# EAGLE design Strain gauge (EAGLE 9.6.2)
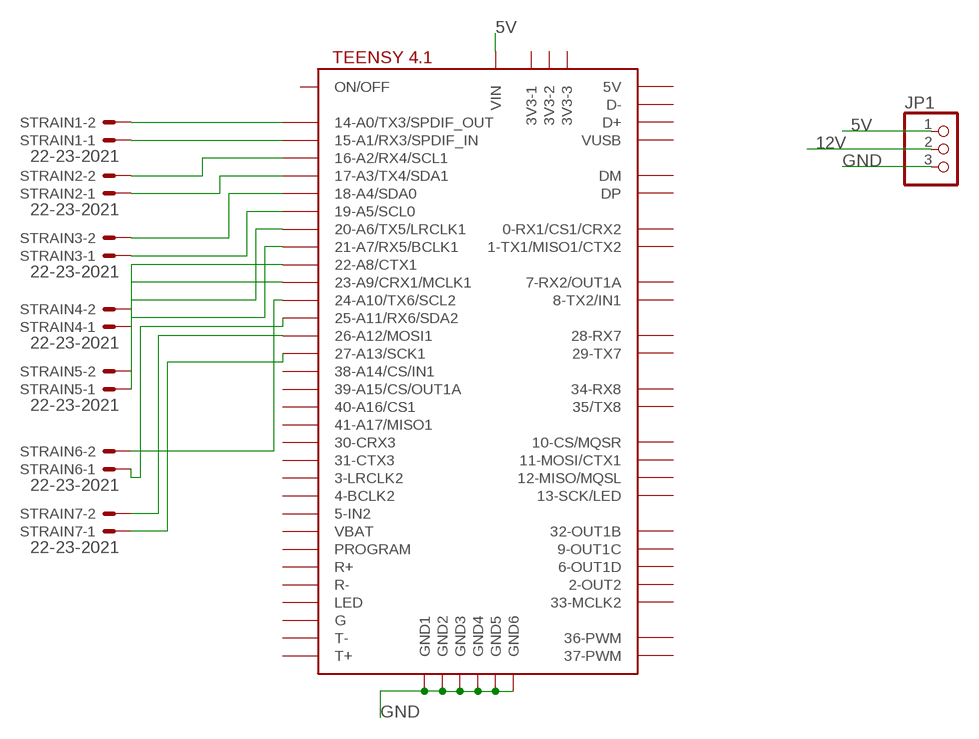
[diagram p0: schematic, sheet 1]

## Parts
JP1  PINHD-1X3  [1X03]
STRAIN1  22-23-2021  [22-23-2021]
STRAIN2  22-23-2021  [22-23-2021]
STRAIN3  22-23-2021  [22-23-2021]
STRAIN4  22-23-2021  [22-23-2021]
STRAIN5  22-23-2021  [22-23-2021]
STRAIN6  22-23-2021  [22-23-2021]
STRAIN7  22-23-2021  [22-23-2021]
U$1  TEENSY41  [TEENSY41]

## Nets
5V: JP1.1 U$1.VIN
12V: JP1.2
GND: JP1.3 U$1.GND1 U$1.GND2 U$1.GND3 U$1.GND4 U$1.GND5 U$1.GND6
N$1: STRAIN1.2 U$1.14-A0/TX3/SPDIF_OUT
N$2: STRAIN1.1 U$1.15-A1/RX3/SPDIF_IN
N$3: STRAIN2.2 U$1.16-A2/RX4/SCL1
N$4: STRAIN2.1 U$1.17-A3/TX4/SDA1
N$5: STRAIN3.2 U$1.18-A4/SDA0
N$6: STRAIN3.1 U$1.19-A5/SCL0
N$7: STRAIN4.2 U$1.20-A6/TX5/LRCLK1
N$8: STRAIN4.1 U$1.21-A7/RX5/BCLK1
N$9: STRAIN5.2 U$1.22-A8/CTX1
N$10: STRAIN5.1 U$1.23-A9/CRX1/MCLK1
N$11: STRAIN6.2 U$1.24-A10/TX6/SCL2
N$12: STRAIN6.1 U$1.25-A11/RX6/SDA2
N$13: STRAIN7.2 U$1.26-A12/MOSI1
N$14: STRAIN7.1 U$1.27-A13/SCK1
Unconnected: U$1.0-RX1/CS1/CRX2 U$1.1-TX1/MISO1/CTX2 U$1.2-OUT2 U$1.3-LRCLK2 U$1.3V3-1 U$1.3V3-2 U$1.3V3-3 U$1.4-BCLK2 U$1.5-IN2 U$1.6-OUT1D U$1.7-RX2/OUT1A U$1.8-TX2/IN2(8-TX2/IN1) U$1.9-OUT1C U$1.10-CS\MQSR(10-CS/MQSR) U$1.11-MOSI/CTX1 U$1.12-MISO/MQSL U$1.13-SCK/LED U$1.28-RX7 U$1.29-TX7 U$1.30-CRX3 U$1.31-CTX3 U$1.32-OUT1B U$1.33-MCLK2 U$1.34-RX8 U$1.35-TX8(35/TX8) U$1.36-PWM U$1.37-PWM U$1.38-A14/CS/IN1 U$1.39-A15/CS/OUT1A U$1.40-A16/CS1 U$1.41-A17/MISO1 U$1.+5V(5V) U$1.D+ U$1.D- U$1.DM U$1.DP U$1.G U$1.LED U$1.ON/OFF U$1.PROGRAM U$1.R+ U$1.R- U$1.T+ U$1.T- U$1.VBAT U$1.VUSB

## Library data of the parts
JP1 = adafruit:PINHD-1X3: PIN HEADER
STRAIN1-STRAIN7 = con-molex:22-23-2021: .100" (2.54mm) Center Header - 2 Pin; MF: MOLEX; MPN: 22-23-2021; OC_FARNELL: 1462926; OC_NEWARK: 25C3832
U$1 = teensy:TEENSY41

## Board
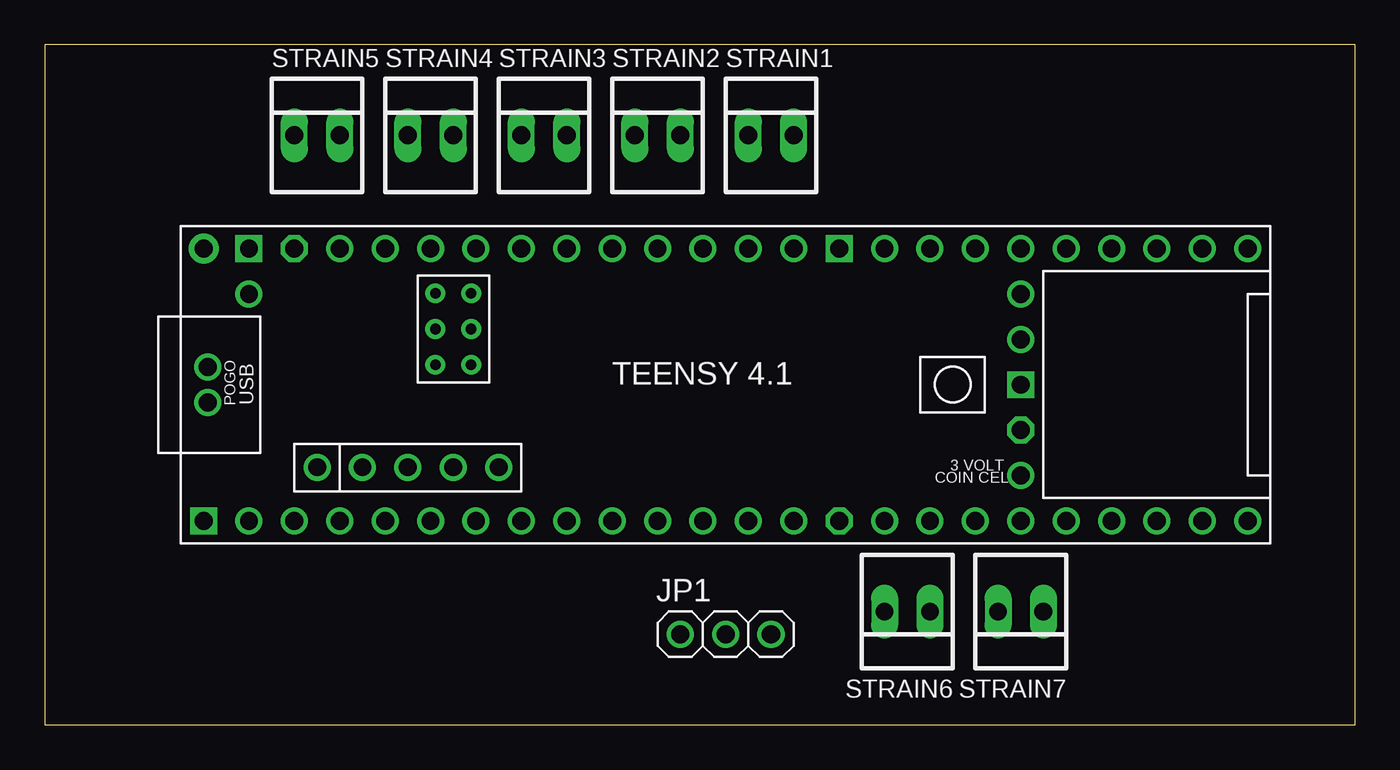
[diagram p1: board, top side]
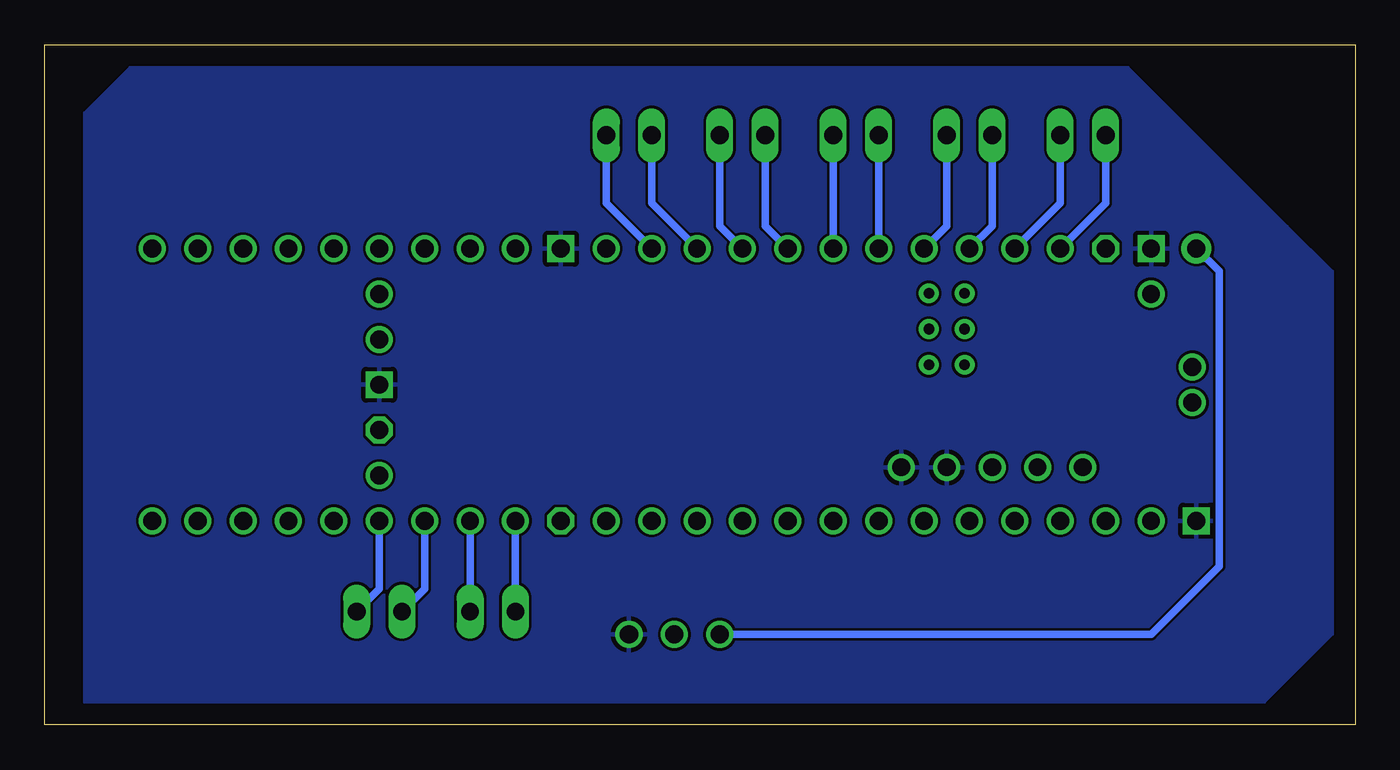
[diagram p2: board, bottom side, seen from below]

Size 73.33 x 38.09 mm. Coordinates in mm from the lower left corner, seen from the top.
Outline: 0,0 73.33,0 73.33,38.09 0,38.09 0,0
Copper layers (1*16): Top 0.035mm / dielectric 1.5mm / Bottom 0.035mm
Design rules "default": minimum track width 6mil, minimum drill 0.35mm, track to track 6mil, track to pad 6mil, pad to pad 6mil, via to via 6mil, smd to smd 6mil, copper to edge 40mil, drill to drill 6mil, minimum pad ring 10mil, minimum via ring 8mil, stop-mask expansion 4mil, vias tented up to drill 0mil, thermal gap 10mil

### Footprints (pad centres in the part's own frame; a part is rotated, then mirrored left to right if it is on the bottom)
1X03 = drill 1.016: 1 -2.54,0; 2 0,0; 3 2.54,0
22-23-2021 = drill 1 long: 1 -1.27,0; 2 1.27,0
TEENSY41 = drill 1: 0-RX1/CS1/CRX2 -27.94,-7.62; 1-TX1/MISO1/CTX2 -25.4,-7.62; 2-OUT2 -22.86,-7.62; 3-LRCLK2 -20.32,-7.62; 4-BCLK2 -17.78,-7.62; 5-IN2 -15.24,-7.62; 6-OUT1D -12.7,-7.62; 7-RX2/OUT1A -10.16,-7.62; 8-TX2/IN2 -7.62,-7.62; 9-OUT1C -5.08,-7.62; 10-CS\MQSR -2.54,-7.62; 11-MOSI/CTX1 0,-7.62; 12-MISO/MQSL 2.54,-7.62; 13-SCK/LED 2.54,7.62; 14-A0/TX3/SPDIF_OUT 0,7.62; 15-A1/RX3/SPDIF_IN -2.54,7.62; 16-A2/RX4/SCL1 -5.08,7.62; 17-A3/TX4/SDA1 -7.62,7.62; 18-A4/SDA0 -10.16,7.62; 19-A5/SCL0 -12.7,7.62; 20-A6/TX5/LRCLK1 -15.24,7.62; 21-A7/RX5/BCLK1 -17.78,7.62; 22-A8/CTX1 -20.32,7.62; 23-A9/CRX1/MCLK1 -22.86,7.62; 24-A10/TX6/SCL2 7.62,-7.62; 25-A11/RX6/SDA2 10.16,-7.62; 26-A12/MOSI1 12.7,-7.62; 27-A13/SCK1 15.24,-7.62; 28-RX7 17.78,-7.62; 29-TX7 20.32,-7.62; 30-CRX3 22.86,-7.62; 31-CTX3 25.4,-7.62; 32-OUT1B 27.94,-7.62; 33-MCLK2 27.94,7.62; 34-RX8 25.4,7.62; 35-TX8 22.86,7.62; 36-PWM 20.32,7.62; 37-PWM 17.78,7.62; 38-A14/CS/IN1 15.24,7.62; 39-A15/CS/OUT1A 12.7,7.62; 40-A16/CS1 10.16,7.62; 41-A17/MISO1 7.62,7.62; +5V -24.13,-4.62; D+ -30.25,-1; D- -30.25,1; DM -21.59,-4.62; DP -19.05,-4.62; GND4 -16.51,-4.62; GND5 -13.97,-4.62; ON/OFF 15.24,5.08; PROGRAM 15.24,2.54; VBAT 15.24,-5.08; VUSB -27.94,5.08 | drill 1 octagon: 3V3-1 5.08,-7.62; 3V3-2 15.24,-2.54; 3V3-3 -25.4,7.62 | drill 0.6: G -15.51,3.12; LED -17.51,3.12; R+ -17.51,5.12; R- -15.51,5.12; T+ -15.51,1.12; T- -17.51,1.12 | drill 1 square: GND1 -30.48,-7.62; GND2 15.24,0; GND3 5.08,7.62; GND6 -27.94,7.62 | drill 1 pad 1.676: VIN -30.48,7.62

### Placement (x,y rotation side)
JP1  38.1,5.08 0 top
STRAIN1  40.64,33.02 0 top
STRAIN2  34.29,33.02 0 top
STRAIN3  27.94,33.02 0 top
STRAIN4  21.59,33.02 0 top
STRAIN5  15.24,33.02 0 top
STRAIN6  48.26,6.35 180 top
STRAIN7  54.61,6.35 180 top
U$1  39.37,19.05 0 top

### Tracks (layer width: path | path; a pad name or v marks a point on that pad's centre or on a via)
5V
  Bottom 0.406: JP1.1 11.43,5.08 7.62,8.89 7.62,25.4 U$1.VIN
GND
  pour Bottom: 1.27,5.08 5.08,1.27 71.12,1.27 71.12,34.29 68.58,36.83 12.7,36.83 3.81,27.94 1.27,25.4
N$1
  Bottom 0.406: STRAIN1.2 41.91,29.21 U$1.14-A0/TX3/SPDIF_OUT
N$2
  Bottom 0.406: STRAIN1.1 39.37,29.21 U$1.15-A1/RX3/SPDIF_IN
N$3
  Bottom 0.406: STRAIN2.2 35.56,27.94 U$1.16-A2/RX4/SCL1
N$4
  Bottom 0.406: STRAIN2.1 33.02,27.94 U$1.17-A3/TX4/SDA1
N$5
  Bottom 0.406: U$1.18-A4/SDA0 STRAIN3.2
N$6
  Bottom 0.406: STRAIN3.1 U$1.19-A5/SCL0
N$7
  Bottom 0.406: STRAIN4.2 22.86,27.94 U$1.20-A6/TX5/LRCLK1
N$8
  Bottom 0.406: STRAIN4.1 20.32,27.94 U$1.21-A7/RX5/BCLK1
N$9
  Bottom 0.406: STRAIN5.2 16.51,29.21 U$1.22-A8/CTX1
N$10
  Bottom 0.406: STRAIN5.1 13.97,29.21 U$1.23-A9/CRX1/MCLK1
N$11
  Bottom 0.406: STRAIN6.2 U$1.24-A10/TX6/SCL2
N$12
  Bottom 0.406: STRAIN6.1 U$1.25-A11/RX6/SDA2
N$13
  Bottom 0.406: STRAIN7.2 52.07,7.62 U$1.26-A12/MOSI1
N$14
  Bottom 0.406: STRAIN7.1 54.61,7.62 U$1.27-A13/SCK1